# Altium schematic sheet MCU.SchDoc
size A4; SheetNumber: 10; SheetTotal: 10
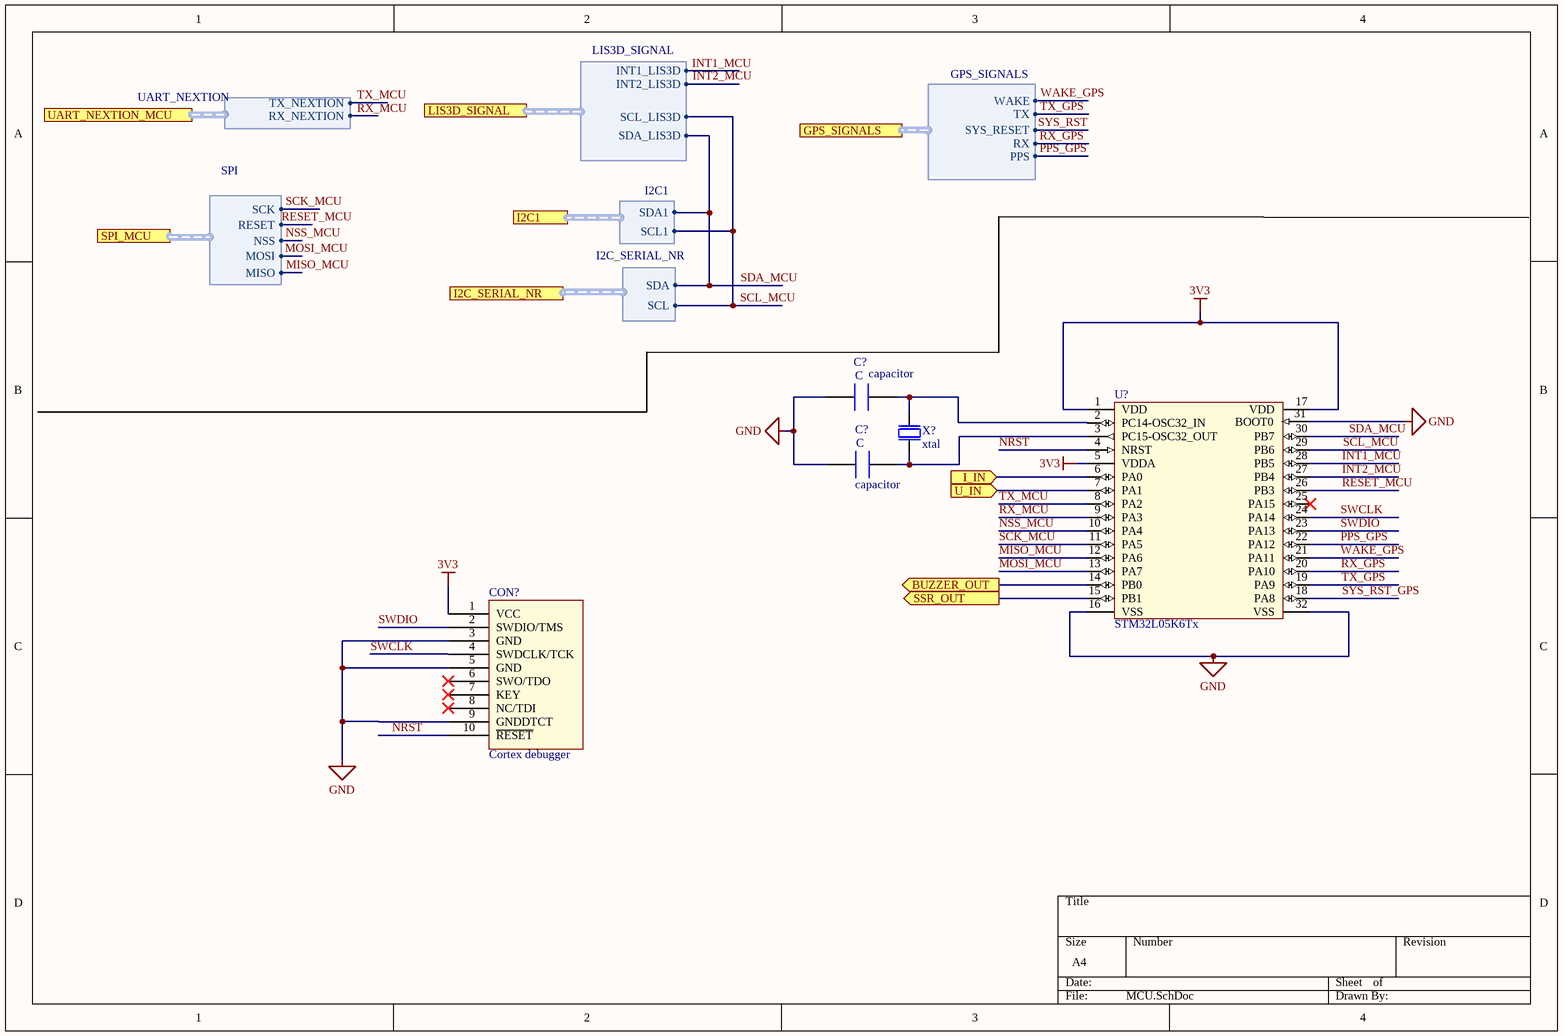
[diagram p0: MCU.SchDoc]

## Parts
(Parts that share a designator on the sheet are numbered #1, #2 ... from top to bottom, then left to right.)
C?#1  capacitor  [CAPC1005X04L]
C?#2  capacitor  [CAPC1005X04L]
CON?  Cortex debugger  [Jtag header]
U?  STM32L05K6Tx
X?  xtal  [BT-XTAL_2016]

## Ports
BUZZER_OUT (out), GPS_SIGNALS (harness GPS_SIGNALS), I2C1 (harness I2C1), I2C_SERIAL_NR (harness I2C_SERIAL_NR), I_IN (in), LIS3D_SIGNAL (harness LIS3D_SIGNAL), SPI_MCU (harness SPI), SSR_OUT (out), U_IN (in), UART_NEXTION_MCU (harness UART_NEXTION)

## Harnesses
UART_NEXTION: RX_NEXTION, TX_NEXTION
SPI: MISO, MOSI, NSS, RESET, SCK
LIS3D_SIGNAL: INT1_LIS3D, INT2_LIS3D, SCL_LIS3D, SDA_LIS3D
I2C1: SCL1, SDA1
I2C_SERIAL_NR: SCL, SDA
GPS_SIGNALS: PPS, RX, SYS_RESET, TX, WAKE

## Nets
3V3: CON?.1(VCC) U?.1(VDD) U?.5(VDDA) U?.17(VDD)
GND: C?#1.2 C?#2.2 CON?.3(GND) CON?.5(GND) CON?.9(GNDDTCT) U?.16(VSS) U?.31(BOOT0) U?.32(VSS)
BUZZER_OUT: U?.14(PB0) ; port BUZZER_OUT
I_IN: U?.6(PA0) ; port I_IN
INT1_MCU: U?.28(PB5)
INT2_MCU: U?.27(PB4) ; port LIS3D_SIGNAL.INT2_LIS3D
MISO_MCU: U?.12(PA6) ; port SPI_MCU.MISO
MOSI_MCU: U?.13(PA7) ; port SPI_MCU.MOSI
NRST: CON?.10(~{RESET}) U?.4(NRST)
NSS_MCU: U?.10(PA4) ; port SPI_MCU.NSS
PPS_GPS: U?.22(PA12) ; port GPS_SIGNALS.PPS
RESET_MCU: U?.26(PB3) ; port SPI_MCU.RESET
RX_GPS: U?.20(PA10) ; port GPS_SIGNALS.RX
RX_MCU: U?.9(PA3) ; harness UART_NEXTION.RX_NEXTION
SCK_MCU: U?.11(PA5) ; port SPI_MCU.SCK
SCL_MCU: U?.29(PB6) ; port LIS3D_SIGNAL.SCL_LIS3D, port I2C1.SCL1, port I2C_SERIAL_NR.SCL
SDA_MCU: U?.30(PB7) ; port LIS3D_SIGNAL.SDA_LIS3D, port I2C1.SDA1, port I2C_SERIAL_NR.SDA
SSR_OUT: U?.15(PB1) ; port SSR_OUT
SWCLK: CON?.4(SWDCLK/TCK) U?.24(PA14)
SWDIO: CON?.2(SWDIO/TMS) U?.23(PA13)
SYS_RST: port GPS_SIGNALS.SYS_RESET
SYS_RST_GPS: U?.18(PA8)
TX_GPS: U?.19(PA9) ; port GPS_SIGNALS.TX
TX_MCU: U?.8(PA2) ; harness UART_NEXTION.TX_NEXTION
U_IN: U?.7(PA1) ; port U_IN
WAKE_GPS: U?.21(PA11) ; port GPS_SIGNALS.WAKE
NetC?#1_1: C?#1.1 U?.2(PC14-OSC32_IN) X?.3(out)
NetC?#2_1: C?#2.1 U?.3(PC15-OSC32_OUT) X?.1(inp)

Not connected (* = marked no-connect by the designer): CON? 6(SWO/TDO)* 7(KEY)* 8(NC/TDI)*; U? 25(PA15)*

## Notes on the sheet
- Labels drawn without touching a wire or pin: INT1_MCU
- (in symbol capacitor) C